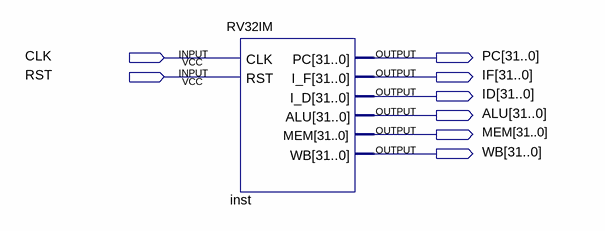
[diagram p0: schematic sheet]
// Quartus schematic RV32IMTEST.bdf as structural Verilog: 1 symbols, 8 pins
module RV32IMTEST (
  input  CLK,
  input  RST,
  output [31:0] PC,
  output [31:0] IF,
  output [31:0] ID,
  output [31:0] ALU,
  output [31:0] MEM,
  output [31:0] WB
);

  RV32IM inst (.CLK(CLK), .RST(RST), .PC(PC), .I_F(IF), .I_D(ID), .ALU(ALU), .MEM(MEM), .WB(WB));
endmodule
